# EAGLE design REZZ-Style_goggles (EAGLE 7.7.0)
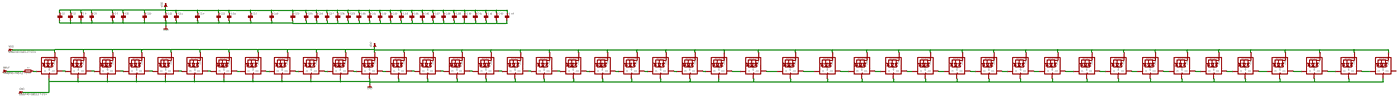
[diagram p0: schematic, sheet 1, overview]
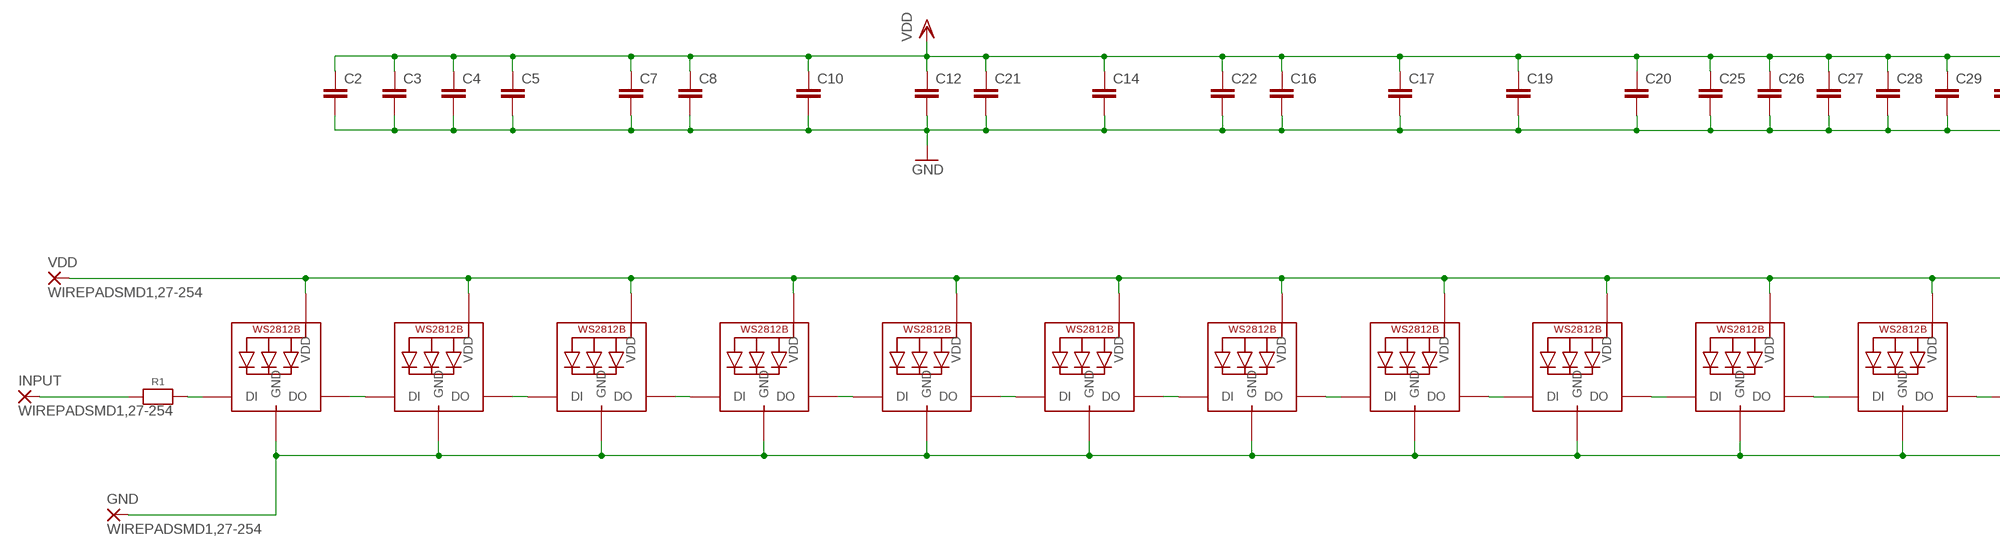
[diagram p1: schematic, sheet 1, part 1 of 4]
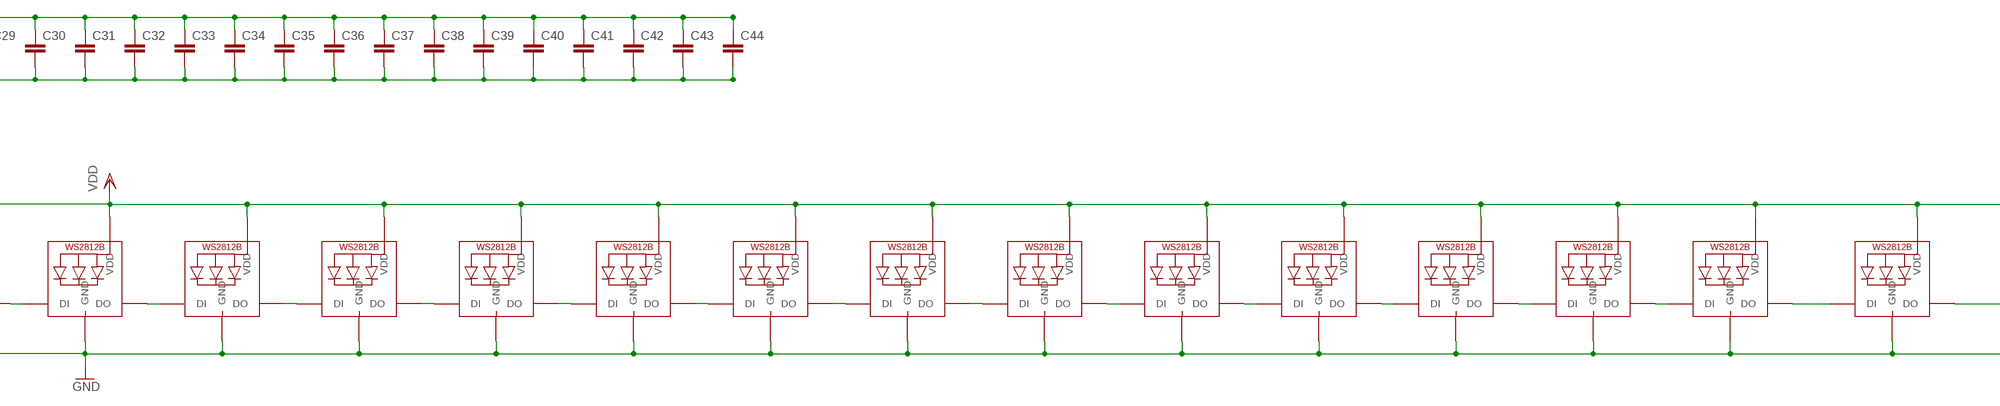
[diagram p2: schematic, sheet 1, part 2 of 4]
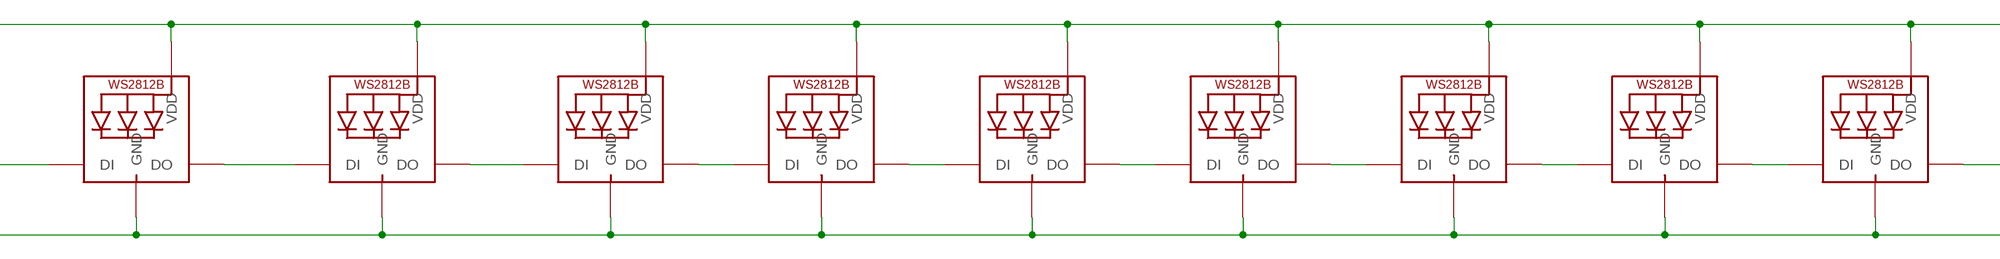
[diagram p3: schematic, sheet 1, part 3 of 4]
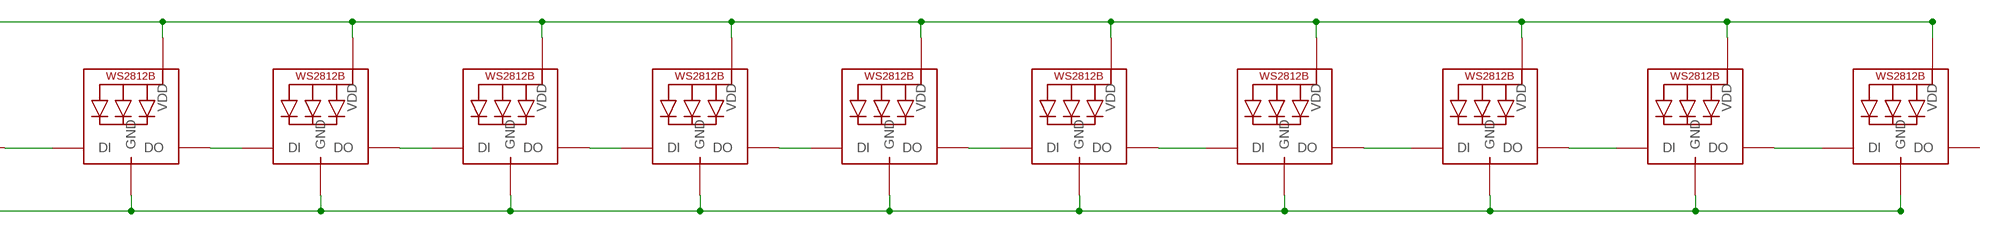
[diagram p4: schematic, sheet 1, part 4 of 4]

## Parts
C2  C-EUC0603  [C0603]
C3  C-EUC0603  [C0603]
C4  C-EUC0603  [C0603]
C5  C-EUC0603  [C0603]
C7  C-EUC0603  [C0603]
C8  C-EUC0603  [C0603]
C10  C-EUC0603  [C0603]
C12  C-EUC0603  [C0603]
C14  C-EUC0603  [C0603]
C16  C-EUC0603  [C0603]
C17  C-EUC0603  [C0603]
C19  C-EUC0603  [C0603]
C20  C-EUC0603  [C0603]
C21  C-EUC0603  [C0603]
C22  C-EUC0603  [C0603]
C25  C-EUC0603  [C0603]
C26  C-EUC0603  [C0603]
C27  C-EUC0603  [C0603]
C28  C-EUC0603  [C0603]
C29  C-EUC0603  [C0603]
C30  C-EUC0603  [C0603]
C31  C-EUC0603  [C0603]
C32  C-EUC0603  [C0603]
C33  C-EUC0603  [C0603]
C34  C-EUC0603  [C0603]
C35  C-EUC0603  [C0603]
C36  C-EUC0603  [C0603]
C37  C-EUC0603  [C0603]
C38  C-EUC0603  [C0603]
C39  C-EUC0603  [C0603]
C40  C-EUC0603  [C0603]
C41  C-EUC0603  [C0603]
C42  C-EUC0603  [C0603]
C43  C-EUC0603  [C0603]
C44  C-EUC0603  [C0603]
GND  WIREPADSMD1,27-254  [SMD1,27-2,54]
INPUT  WIREPADSMD1,27-254  [SMD1,27-2,54]
LED1  WS2812B3535  [LED3535]
LED2  WS2812B3535  [LED3535]
LED3  WS2812B3535  [LED3535]
LED4  WS2812B3535  [LED3535]
LED5  WS2812B3535  [LED3535]
LED6  WS2812B3535  [LED3535]
LED7  WS2812B3535  [LED3535]
LED8  WS2812B3535  [LED3535]
LED9  WS2812B3535  [LED3535]
LED10  WS2812B3535  [LED3535]
LED11  WS2812B3535  [LED3535]
LED12  WS2812B3535  [LED3535]
LED13  WS2812B3535  [LED3535]
LED14  WS2812B3535  [LED3535]
LED15  WS2812B3535  [LED3535]
LED16  WS2812B3535  [LED3535]
LED17  WS2812B3535  [LED3535]
LED18  WS2812B3535  [LED3535]
LED19  WS2812B3535  [LED3535]
LED20  WS2812B3535  [LED3535]
LED21  WS2812B3535  [LED3535]
LED22  WS2812B3535  [LED3535]
LED23  WS2812B3535  [LED3535]
LED24  WS2812B3535  [LED3535]
LED25  WS2812B3535  [LED3535]
LED26  WS2812B3535  [LED3535]
LED27  WS2812B3535  [LED3535]
LED28  WS2812B3535  [LED3535]
LED29  WS2812B3535  [LED3535]
LED30  WS2812B3535  [LED3535]
LED31  WS2812B3535  [LED3535]
LED32  WS2812B3535  [LED3535]
LED33  WS2812B3535  [LED3535]
LED34  WS2812B3535  [LED3535]
LED35  WS2812B3535  [LED3535]
LED36  WS2812B3535  [LED3535]
LED37  WS2812B3535  [LED3535]
LED38  WS2812B3535  [LED3535]
LED39  WS2812B3535  [LED3535]
LED40  WS2812B3535  [LED3535]
LED41  WS2812B3535  [LED3535]
LED42  WS2812B3535  [LED3535]
LED43  WS2812B3535  [LED3535]
LED44  WS2812B3535  [LED3535]
R1  RESISTOR_0603_NOOUT  [0603-NO]
VDD  WIREPADSMD1,27-254  [SMD1,27-2,54]

## Nets
GND: C2.2 C3.2 C4.2 C5.2 C7.2 C8.2 C10.2 C12.2 C14.2 C16.2 C17.2 C19.2 C20.2 C21.2 C22.2 C25.2 C26.2 C27.2 C28.2 C29.2 C30.2 C31.2 C32.2 C33.2 C34.2 C35.2 C36.2 C37.2 C38.2 C39.2 C40.2 C41.2 C42.2 C43.2 C44.2 GND.1(P) LED1.4(GND) LED2.4(GND) LED3.4(GND) LED4.4(GND) LED5.4(GND) LED6.4(GND) LED7.4(GND) LED8.4(GND) LED9.4(GND) LED10.4(GND) LED11.4(GND) LED12.4(GND) LED13.4(GND) LED14.4(GND) LED15.4(GND) LED16.4(GND) LED17.4(GND) LED18.4(GND) LED19.4(GND) LED20.4(GND) LED21.4(GND) LED22.4(GND) LED23.4(GND) LED24.4(GND) LED25.4(GND) LED26.4(GND) LED27.4(GND) LED28.4(GND) LED29.4(GND) LED30.4(GND) LED31.4(GND) LED32.4(GND) LED33.4(GND) LED34.4(GND) LED35.4(GND) LED36.4(GND) LED37.4(GND) LED38.4(GND) LED39.4(GND) LED40.4(GND) LED41.4(GND) LED42.4(GND) LED43.4(GND) LED44.4(GND)
N$1: LED1.3(DO) LED2.1(DI)
N$2: LED2.3(DO) LED3.1(DI)
N$3: LED3.3(DO) LED4.1(DI)
N$4: LED4.3(DO) LED5.1(DI)
N$5: LED5.3(DO) LED6.1(DI)
N$6: LED6.3(DO) LED7.1(DI)
N$7: LED7.3(DO) LED8.1(DI)
N$8: LED8.3(DO) LED9.1(DI)
N$9: LED9.3(DO) LED10.1(DI)
N$10: LED10.3(DO) LED11.1(DI)
N$11: LED11.3(DO) LED12.1(DI)
N$12: LED12.3(DO) LED13.1(DI)
N$13: LED13.3(DO) LED14.1(DI)
N$14: LED14.3(DO) LED15.1(DI)
N$15: LED15.3(DO) LED16.1(DI)
N$16: LED16.3(DO) LED17.1(DI)
N$17: LED17.3(DO) LED18.1(DI)
N$18: LED18.3(DO) LED19.1(DI)
N$19: LED19.3(DO) LED20.1(DI)
N$20: LED20.3(DO) LED21.1(DI)
N$21: LED21.3(DO) LED22.1(DI)
N$22: LED22.3(DO) LED23.1(DI)
N$23: LED23.3(DO) LED24.1(DI)
N$24: LED24.3(DO) LED25.1(DI)
N$25: LED1.1(DI) R1.2
N$26: INPUT.1(P) R1.1
N$27: LED25.3(DO) LED26.1(DI)
N$28: LED26.3(DO) LED27.1(DI)
N$29: LED27.3(DO) LED28.1(DI)
N$30: LED28.3(DO) LED29.1(DI)
N$31: LED29.3(DO) LED30.1(DI)
N$32: LED30.3(DO) LED31.1(DI)
N$33: LED31.3(DO) LED32.1(DI)
N$34: LED32.3(DO) LED33.1(DI)
N$35: LED33.3(DO) LED34.1(DI)
N$36: LED34.3(DO) LED35.1(DI)
N$37: LED35.3(DO) LED36.1(DI)
N$38: LED36.3(DO) LED37.1(DI)
N$39: LED37.3(DO) LED38.1(DI)
N$40: LED38.3(DO) LED39.1(DI)
N$41: LED39.3(DO) LED40.1(DI)
N$42: LED40.3(DO) LED41.1(DI)
N$43: LED41.3(DO) LED42.1(DI)
N$44: LED42.3(DO) LED43.1(DI)
N$45: LED43.3(DO) LED44.1(DI)
VDD: C2.1 C3.1 C4.1 C5.1 C7.1 C8.1 C10.1 C12.1 C14.1 C16.1 C17.1 C19.1 C20.1 C21.1 C22.1 C25.1 C26.1 C27.1 C28.1 C29.1 C30.1 C31.1 C32.1 C33.1 C34.1 C35.1 C36.1 C37.1 C38.1 C39.1 C40.1 C41.1 C42.1 C43.1 C44.1 LED1.2(VDD) LED2.2(VDD) LED3.2(VDD) LED4.2(VDD) LED5.2(VDD) LED6.2(VDD) LED7.2(VDD) LED8.2(VDD) LED9.2(VDD) LED10.2(VDD) LED11.2(VDD) LED12.2(VDD) LED13.2(VDD) LED14.2(VDD) LED15.2(VDD) LED16.2(VDD) LED17.2(VDD) LED18.2(VDD) LED19.2(VDD) LED20.2(VDD) LED21.2(VDD) LED22.2(VDD) LED23.2(VDD) LED24.2(VDD) LED25.2(VDD) LED26.2(VDD) LED27.2(VDD) LED28.2(VDD) LED29.2(VDD) LED30.2(VDD) LED31.2(VDD) LED32.2(VDD) LED33.2(VDD) LED34.2(VDD) LED35.2(VDD) LED36.2(VDD) LED37.2(VDD) LED38.2(VDD) LED39.2(VDD) LED40.2(VDD) LED41.2(VDD) LED42.2(VDD) LED43.2(VDD) LED44.2(VDD) VDD.1(P)
Unconnected: LED44.3(DO)

## Library data of the parts
C2-C5 C7 C8 C10 C12 C14 C16 C17 C19-C22 C25-C44 = rcl:C-EU: CAPACITOR, European symbol
GND INPUT VDD = wirepad:WIREPAD: Wire PAD connect wire on PCB
LED1-LED44 = adafruit:WS2812B
R1 = microbuilder:RESISTOR: Resistors For new designs, use the packages preceded by an '_' character since they are more reliable: The following footprints should be used on most boards: _0402 - Standard footprint for regular board layouts _0603 - Standard footprint for regular board layouts _0805 - Standard footprint for regular board layouts _1206 - Standard footprint for regular board layouts For extremely tight-pitch boards where space is at a premium, the following 'micro-pitch' footprints can be used (smaller pads, no silkscreen outline, etc.): _0402MP - Micro-pitch footprint for very dense/compact boards _0603MP - Micro-pitch footprint for very dense/compact boards _0805MP - Micro-pitch footprint for very dense/compact boards _1206MP - Micro-pitch footprint for very dense/compact boards

## Board
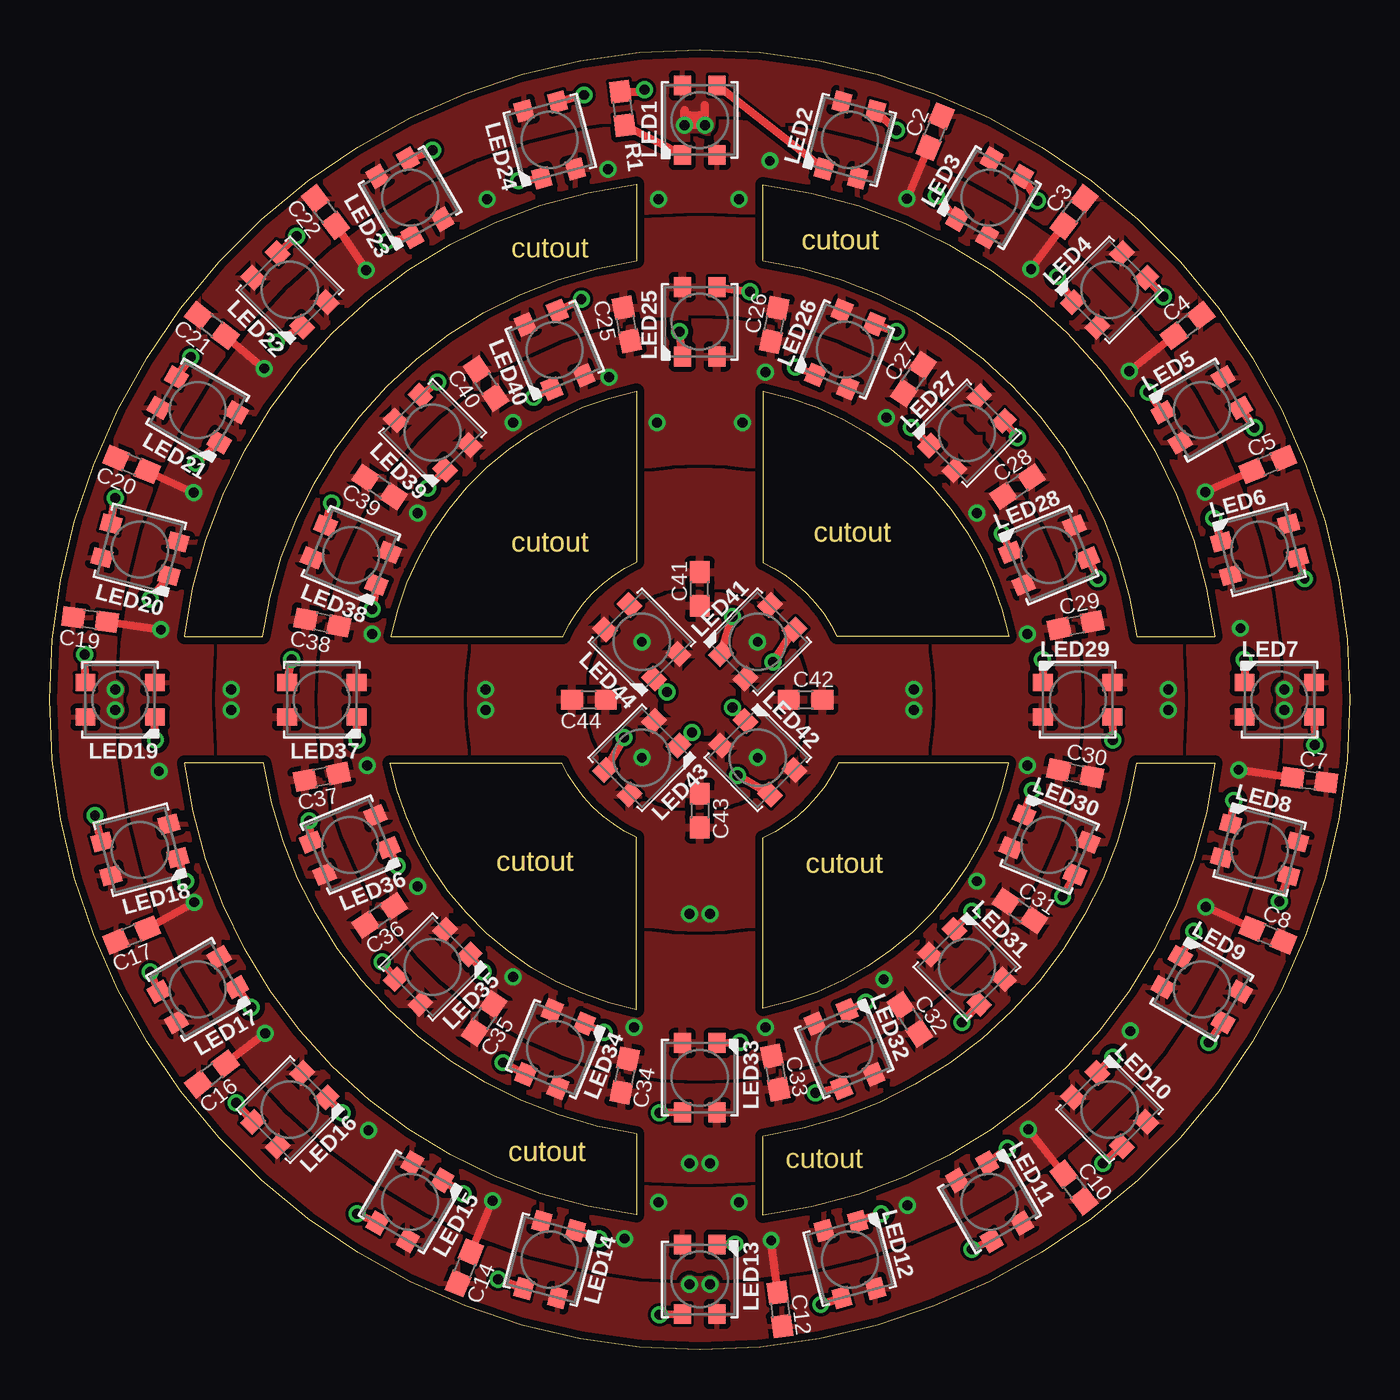
[diagram p5: board, top side]
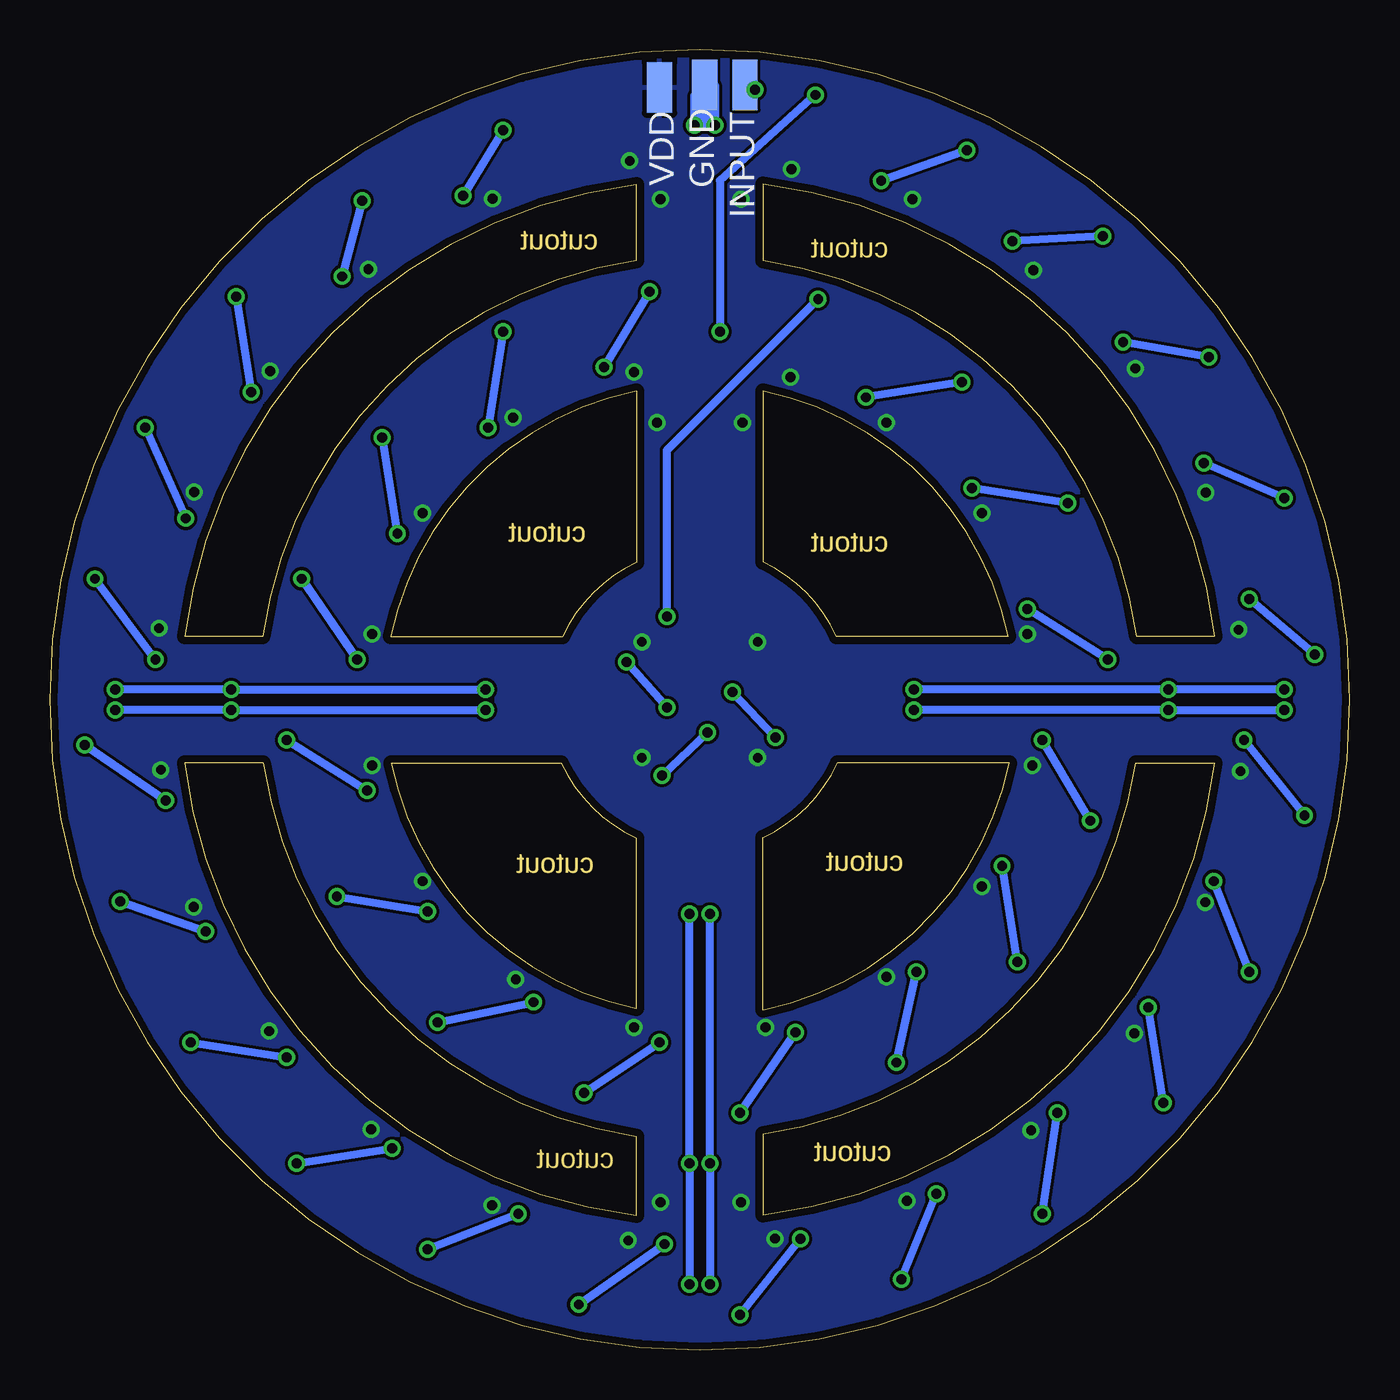
[diagram p6: board, bottom side, seen from below]

Size 65.53 x 65.53 mm. Coordinates in mm from the lower left corner, seen from the top.
Outline: 0,32.77 arc-90 32.77,65.53 arc-90 65.53,32.77 arc-90 32.77,0 arc-90 0,32.77
Outline: 10.79,29.59 6.81,29.59 arc76 29.59,6.81 29.59,10.9 arc-73 10.79,29.59
Outline: 54.76,29.59 58.73,29.59 arc-76 35.94,6.78 35.94,10.77 arc74 54.76,29.59
Outline: 6.81,35.94 10.74,35.94 arc-74 29.59,54.89 29.59,58.75 arc76 6.81,35.94
Outline: 54.79,35.94 58.73,35.94 arc76 35.94,58.73 35.94,54.89 arc-74 54.79,35.94
Outline: 17.21,35.94 25.87,35.94 arc-41 29.59,39.71 29.59,48.32 arc67 17.21,35.94
Outline: 48.35,35.94 39.69,35.94 arc41 35.94,39.69 35.94,48.32 arc-67 48.35,35.94
Outline: 48.32,29.59 39.75,29.59 arc-41 35.94,25.81 35.94,17.21 arc67 48.32,29.59
Outline: 17.17,29.59 25.83,29.59 arc41 29.59,25.83 29.59,17.14 arc-67 17.17,29.59
Copper layers (1*16): Top 0.0356mm / dielectric 1.5011mm / Bottom 0.0356mm
Design rules "oshpark-2layer *": minimum track width 6mil, minimum drill 13mil, track to track 6mil, track to pad 6mil, pad to pad 6mil, via to via 6mil, smd to smd 6mil, copper to edge 15mil, drill to drill 6mil, minimum pad ring 7mil, minimum via ring 7mil, stop-mask expansion 2.5mil, vias tented up to drill 20mil, thermal gap 10mil

### Footprints (pad centres in the part's own frame; a part is rotated, then mirrored left to right if it is on the bottom)
C0603 = smd 1.1 x 1: 1 -0.85,0; 2 0.85,0
SMD1,27-2,54 = smd 1.27 x 2.54: 1 0,0
LED3535 = smd 1 x 0.85: 1 -1.75,0.875; 2 -1.75,-0.875; 3 1.75,-0.875; 4 1.75,0.875
0603-NO = smd 1.1 x 1: 1 -0.85,0; 2 0.85,0

### Placement (x,y rotation side)
C2  44.62,61.4 67.5 top
C3  51.63,57.35 52.5 top
C4  57.35,51.63 37.5 top
C5  61.4,44.62 22.5 top
C7  63.49,28.72 352.5 top
C8  61.4,20.91 337.5 top
C10  51.63,8.18 307.5 top
C12  36.81,2.04 277.5 top
C14  20.91,4.14 247.5 top
C16  8.18,13.9 217.5 top
C17  4.14,20.91 202.5 top
C19  2.04,36.81 172.5 top
C20  4.14,44.62 157.5 top
C21  8.18,51.63 142.5 top
C22  13.9,57.35 127.5 top
C25  29.08,51.69 101.3 top
C26  36.53,51.66 78.8 top
C27  43.54,48.92 56.3 top
C28  48.77,43.51 33.8 top
C29  51.71,36.53 11.3 top
C30  51.69,29.06 348.8 top
C31  48.9,22.12 326.3 top
C32  43.36,16.66 303.8 top
C33  36.58,13.97 281.3 top
C34  28.98,13.82 258.8 top
C35  21.89,16.71 236.3 top
C36  16.64,21.89 213.8 top
C37  13.72,28.88 191.3 top
C38  13.74,36.65 168.8 top
C39  16.64,43.48 146.3 top
C40  22,48.69 123.8 top
C41  32.77,38.35 90 top
C42  38.1,32.77 0 top
C43  32.77,27.18 270 top
C44  27.18,32.77 180 top
GND  32.51,63.75 0 bottom
INPUT  30.48,63.75 0 bottom
LED1  32.77,61.98 90 top
LED2  40.33,60.98 75 top
LED3  47.37,58.06 60 top
LED4  53.42,53.42 45 top
LED5  58.06,47.37 30 top
LED6  60.98,40.33 15 top
LED7  61.98,32.77 0 top
LED8  60.98,25.21 345 top
LED9  58.06,18.16 330 top
LED10  53.42,12.11 315 top
LED11  47.37,7.47 300 top
LED12  40.33,4.55 285 top
LED13  32.77,3.56 270 top
LED14  25.21,4.55 255 top
LED15  18.16,7.47 240 top
LED16  12.11,12.11 225 top
LED17  7.47,18.16 210 top
LED18  4.55,25.21 195 top
LED19  3.56,32.77 180 top
LED20  4.55,40.33 165 top
LED21  7.47,47.37 150 top
LED22  12.11,53.42 135 top
LED23  18.16,58.06 120 top
LED24  25.21,60.98 105 top
LED25  32.77,51.82 90 top
LED26  40.08,50.42 67.5 top
LED27  46.23,46.2 45 top
LED28  50.37,40.06 22.5 top
LED29  51.82,32.77 0 top
LED30  50.39,25.45 337.5 top
LED31  46.23,19.3 315 top
LED32  40.06,15.16 292.5 top
LED33  32.77,13.72 270 top
LED34  25.48,15.16 247.5 top
LED35  19.3,19.3 225 top
LED36  15.14,25.45 202.5 top
LED37  13.72,32.77 180 top
LED38  15.19,40.06 157.5 top
LED39  19.3,46.23 135 top
LED40  25.45,50.39 112.5 top
LED41  35.69,35.69 45 top
LED42  35.69,29.85 315 top
LED43  29.84,29.85 225 top
LED44  29.84,35.69 135 top
R1  28.87,62.57 277.5 top
VDD  34.79,63.62 0 bottom

### Tracks (layer width: path | path; a pad name or v marks a point on that pad's centre or on a via)
GND  (via drill 0.5)
  Top 0.406: v32,61.72 32,62.48 | 33.02,62.74 v33.02,61.72 v32,61.72 | v32,61.72 32.26,61.72 32.26,62.23 32.77,62.23 32.77,61.98 32.51,61.98
  Bottom 0.406: v32.26,3.3 v32.26,9.4 v32.26,21.97 | v33.27,3.3 v33.27,9.4 v33.27,21.97 | v62.23,33.27 v56.39,33.27 v43.56,33.27 | v62.23,32.26 v56.39,32.26 v43.56,32.26 | v3.3,33.27 v9.14,33.27 v21.97,33.27 | v3.3,32.26 v9.14,32.26 v21.97,32.26 | v33.02,61.72 33.02,63.25 32.51,63.25 GND.1 32,63.75 v32,61.72 v33.02,61.72 | v33.02,61.72 32.77,61.72 32.77,62.48 32.26,62.48 32.26,61.98 32.51,61.98 32.51,62.23
  pour Top (rank 6): -0.25,66.04 0.51,-0.76 66.29,-1.27 65.53,65.53
  pour Top (isolate 0.254, rank 4): 8.64,32.77 arc-90 32.77,56.9 32.79,56.9 arc-90 56.92,32.77 arc-90 32.77,8.61 arc-90
  pour Top (rank 2): 21.34,32.77 arc-90 32.77,44.2 arc-90 44.2,32.77 arc-90 32.77,21.34 arc-90
  pour Top (isolate 0.254, rank 4): 8.64,32.77 arc-90 32.77,56.9 32.79,56.9 arc-90 56.92,32.77 arc-90 32.77,8.61 arc-90
N$1
  Top 0.406: LED1.3 LED2.1
N$2  (via drill 0.5)
  Top 0.406: LED2.3 v42.67,61.47 | LED3.1 v44.7,58.17
  Bottom 0.406: v42.67,61.47 v44.7,58.17
N$3  (via drill 0.5)
  Top 0.406: LED3.3 v49.78,57.91 | LED4.1 v50.8,54.1
  Bottom 0.406: v49.78,57.91 v50.8,54.1
N$4  (via drill 0.5)
  Top 0.406: LED4.3 v56.13,53.09 | v55.37,48.26 LED5.1
  Bottom 0.406: v56.13,53.09 v55.37,48.26
N$5  (via drill 0.5)
  Top 0.406: LED5.3 v60.71,46.48 | v58.67,41.91 LED6.1
  Bottom 0.406: v60.71,46.48 v58.67,41.91
N$6  (via drill 0.5)
  Top 0.406: LED6.3 v63.25,38.86 | v60.2,34.8 LED7.1
  Bottom 0.406: v63.25,38.86 v60.2,34.8
N$7  (via drill 0.5)
  Top 0.406: LED7.3 v63.75,30.48 | v59.69,27.69 LED8.1
  Bottom 0.406: v63.75,30.48 v59.69,27.69
N$8  (via drill 0.5)
  Top 0.406: LED8.3 v61.98,22.61 | v57.66,21.08 LED9.1
  Bottom 0.406: v61.98,22.61 v57.66,21.08
N$9  (via drill 0.5)
  Top 0.406: LED9.3 v58.42,15.49 | v53.59,14.73 LED10.1
  Bottom 0.406: v58.42,15.49 v53.59,14.73
N$10  (via drill 0.5)
  Top 0.406: LED10.3 v53.09,9.4 | v48.26,10.16 LED11.1
  Bottom 0.406: v53.09,9.4 v48.26,10.16
N$11  (via drill 0.5)
  Top 0.406: LED11.3 v46.48,5.08 | v41.91,6.86 LED12.1
  Bottom 0.406: v46.48,5.08 v41.91,6.86
N$12  (via drill 0.5)
  Top 0.406: LED12.3 v38.86,2.29 | v34.54,5.33 LED13.1
  Bottom 0.406: v38.86,2.29 v34.54,5.33
N$13  (via drill 0.5)
  Top 0.406: LED13.3 v30.73,1.78 | v27.69,5.59 LED14.1
  Bottom 0.406: v30.73,1.78 v27.69,5.59
N$14  (via drill 0.5)
  Top 0.406: LED14.3 v22.61,3.56 | v20.83,7.87 LED15.1
  Bottom 0.406: v22.61,3.56 v20.83,7.87
N$15  (via drill 0.5)
  Top 0.406: LED15.3 v15.49,6.86 | v14.73,11.94 LED16.1
  Bottom 0.406: v15.49,6.86 v14.73,11.94
N$16  (via drill 0.5)
  Top 0.406: LED16.3 v9.4,12.45 | v10.16,17.27 LED17.1
  Bottom 0.406: v9.4,12.45 v10.16,17.27
N$17  (via drill 0.5)
  Top 0.406: LED17.3 v5.08,19.05 | v6.86,23.62 LED18.1
  Bottom 0.406: v5.08,19.05 v6.86,23.62
N$18  (via drill 0.5)
  Top 0.406: LED18.3 v2.29,26.92 | v5.33,30.73 LED19.1
  Bottom 0.406: v2.29,26.92 v5.33,30.73
N$19  (via drill 0.5)
  Top 0.406: LED19.3 v1.78,35.05 | v5.08,37.85 LED20.1
  Bottom 0.406: v1.78,35.05 v5.08,37.85
N$20  (via drill 0.5)
  Top 0.406: LED20.3 v3.3,42.93 | v7.37,44.7 LED21.1
  Bottom 0.406: v3.3,42.93 v7.37,44.7
N$21  (via drill 0.5)
  Top 0.406: LED21.3 v7.11,50.04 | v11.43,50.8 LED22.1
  Bottom 0.406: v7.11,50.04 v11.43,50.8
N$22  (via drill 0.5)
  Top 0.406: LED22.3 v12.45,56.13 | v17.02,55.88 LED23.1
  Bottom 0.406: v12.45,56.13 v17.02,55.88
N$23  (via drill 0.5)
  Top 0.406: LED23.3 v19.3,60.45 | v23.62,58.93 LED24.1
  Bottom 0.406: v19.3,60.45 v23.62,58.93
N$24  (via drill 0.5)
  Top 0.406: 25.6,62.79 LED24.3 v26.92,63.25 | LED25.1 v31.75,51.31
  Bottom 0.406: v26.92,63.25 31.75,58.93 v31.75,51.31
N$25
  Top 0.406: R1.2 LED1.1
N$26  (via drill 0.5)
  Top 0.406: R1.1 29.97,63.41 v29.97,63.5
  Bottom 0.406: v29.97,63.5 30.48,63.5 INPUT.1
N$27  (via drill 0.5)
  Top 0.406: LED25.3 v35.31,53.34 | LED26.1 v37.59,49.53
  Bottom 0.406: v35.31,53.34 v37.59,49.53
N$28  (via drill 0.5)
  Top 0.406: LED26.3 v42.67,51.31 | v43.43,46.48 LED27.1
  Bottom 0.406: v42.67,51.31 v43.43,46.48
N$29  (via drill 0.5)
  Top 0.406: LED27.3 v48.77,45.97 | v48.01,41.15 LED28.1
  Bottom 0.406: v48.77,45.97 v48.01,41.15
N$30  (via drill 0.5)
  Top 0.406: LED28.3 v52.83,38.86 | v50.04,34.8 LED29.1
  Bottom 0.406: v52.83,38.86 v50.04,34.8
N$31  (via drill 0.5)
  Top 0.406: LED29.3 v53.59,30.73 | LED30.1 v49.53,28.19
  Bottom 0.406: v53.59,30.73 v49.53,28.19
N$32  (via drill 0.5)
  Top 0.406: LED30.3 v51.05,22.86 | LED31.1 v46.48,22.1
  Bottom 0.406: v51.05,22.86 v46.48,22.1
N$33  (via drill 0.5)
  Top 0.406: LED31.3 v45.97,16.51 | LED32.1 v41.15,17.53
  Bottom 0.406: v45.97,16.51 v41.15,17.53
N$34  (via drill 0.5)
  Top 0.406: LED32.3 v38.61,12.95 | LED33.1 v34.8,15.49
  Bottom 0.406: v38.61,12.95 v34.8,15.49
N$35  (via drill 0.5)
  Top 0.406: LED33.3 v30.73,11.94 | LED34.1 v27.94,16
  Bottom 0.406: v30.73,11.94 v27.94,16
N$36  (via drill 0.5)
  Top 0.406: LED34.3 v22.86,14.48 | LED35.1 v21.84,19.05
  Bottom 0.406: v22.86,14.48 v21.84,19.05
N$37  (via drill 0.5)
  Top 0.406: LED35.3 v16.76,19.56 | LED36.1 v17.53,24.38
  Bottom 0.406: v16.76,19.56 v17.53,24.38
N$38  (via drill 0.5)
  Top 0.406: LED36.3 v13.08,26.67 | LED37.1 v15.49,30.73
  Bottom 0.406: v13.08,26.67 v15.49,30.73
N$39  (via drill 0.5)
  Top 0.406: LED37.3 v12.19,34.8 | LED38.1 v16.26,37.34
  Bottom 0.406: v12.19,34.8 v16.26,37.34
N$40  (via drill 0.5)
  Top 0.406: LED38.3 v14.22,42.67 | LED39.1 v19.05,43.43
  Bottom 0.406: v14.22,42.67 v19.05,43.43
N$41  (via drill 0.5)
  Top 0.406: LED39.3 v19.56,48.77 | LED40.1 v24.38,48.01
  Bottom 0.406: v19.56,48.77 v24.38,48.01
N$42  (via drill 0.5)
  Top 0.406: LED41.1 v34.42,36.96 | LED40.3 v26.8,52.96
  Bottom 0.406: v34.42,36.96 34.42,45.34 v26.8,52.96
N$43  (via drill 0.5)
  Top 0.406: v36.45,34.67 LED41.3 | v34.42,32.39 LED42.1
  Bottom 0.406: v36.45,34.67 v34.42,32.39
N$44  (via drill 0.5)
  Top 0.406: LED42.3 v34.67,28.96 | LED43.1 v32.39,31.11
  Bottom 0.406: v34.67,28.96 v32.39,31.11
N$45  (via drill 0.5)
  Top 0.406: v28.96,30.86 LED43.3 | LED44.1 v31.11,33.15
  Bottom 0.406: v28.96,30.86 v31.11,33.15
VDD  (via drill 0.5)
  Top 0.406: C2.1 v43.21,58.01 | C3.1 v49.47,54.46 | C4.1 v54.41,49.32 | C5.1 v58.24,43.22 | C7.1 v59.92,29.24 | C8.1 v58.26,22.32 | C10.1 v49.32,11.12 | C12.1 v36.37,5.51 | C14.1 v22.32,7.52 | C16.1 v10.87,15.96 | C17.1 v7.29,22.56 | C19.1 v5.61,36.29 | C20.1 v7.27,43.21 | C21.1 v10.82,49.47 | C22.1 v15.96,54.41
  other vias: 28.15,59.51 36.29,59.92 60.02,36.37 54.46,16.07 43.22,7.29 28.98,5.61 16.07,11.07 5.51,29.16 22.05,57.99 28.19,49.02 36.07,49.28 42.16,46.99 46.74,42.16 49.28,36.07 49.28,29.46 46.74,23.62 42.04,18.67 36.07,16.26 29.46,16.26 23.37,18.8 18.54,23.37 16,29.46 16.26,36.07 18.54,42.16 23.37,46.74 30.69,57.99 34.75,57.99 30.69,7.44 34.75,7.44 29.84,29.85 29.84,35.69 35.69,29.85 35.69,35.69 30.61,46.74 34.93,46.74
  pour Bottom: 0.25,66.04 -0.51,-1.27 66.29,-1.02 67.06,66.29
  pour Top (isolate 0.254, rank 5): 32.77,61.97 arc-90 61.97,32.77 arc-90 32.77,3.57 arc-180
  pour Top (isolate 0.254, rank 3): 13.72,32.77 arc-90 32.77,51.82 32.79,51.82 arc-90 51.82,32.79 51.82,32.77 arc-90 32.79,13.74 32.74,13.74 arc-90
  pour Top: 27.3,32.77 arc-90 32.64,38.1 32.77,38.1 arc-90 37.97,32.89 37.97,32.77 37.97,32.64 arc-90 32.77,27.43 32.64,27.43 arc-90

### Text on the board
Dimension: cutout | cutout | cutout | cutout | cutout | cutout | cutout | cutout | cutout | cutout | cutout | cutout | cutout | cutout